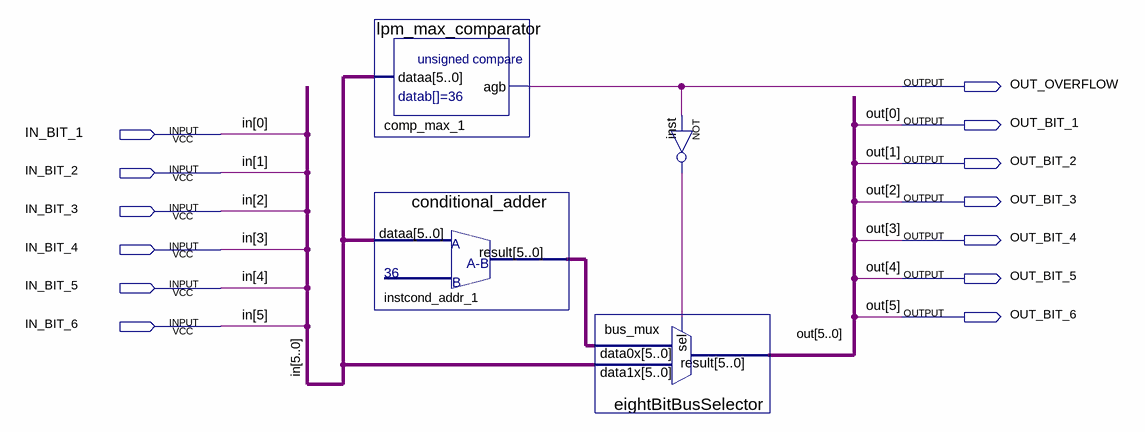
[diagram p0: schematic sheet]
// Quartus schematic counter_limiter_36.bdf as structural Verilog: 4 symbols, 13 pins
module counter_limiter_36 (
  input  IN_BIT_1,
  input  IN_BIT_2,
  input  IN_BIT_3,
  input  IN_BIT_4,
  input  IN_BIT_5,
  input  IN_BIT_6,
  output OUT_OVERFLOW,
  output OUT_BIT_1,
  output OUT_BIT_2,
  output OUT_BIT_3,
  output OUT_BIT_4,
  output OUT_BIT_5,
  output OUT_BIT_6
);

  wire inst_out;
  wire [5:0] instcond_addr_1_result;

  lpm_max_comparator comp_max_1 (
    .dataa({IN_BIT_6, IN_BIT_5, IN_BIT_4, IN_BIT_3, IN_BIT_2, IN_BIT_1}), .agb(OUT_OVERFLOW));
  conditional_adder instcond_addr_1 (
    .dataa({IN_BIT_6, IN_BIT_5, IN_BIT_4, IN_BIT_3, IN_BIT_2, IN_BIT_1}), .result(instcond_addr_1_result));
  eightBitBusSelector bus_mux (
    .data1x({IN_BIT_6, IN_BIT_5, IN_BIT_4, IN_BIT_3, IN_BIT_2, IN_BIT_1}), .data0x(instcond_addr_1_result),
    .sel(inst_out), .result({OUT_BIT_6, OUT_BIT_5, OUT_BIT_4, OUT_BIT_3, OUT_BIT_2, OUT_BIT_1}));
  not inst (inst_out, OUT_OVERFLOW);

  // Other names for the same wires on the sheet: in[5:0] = {IN_BIT_6, IN_BIT_5, IN_BIT_4, IN_BIT_3, IN_BIT_2, IN_BIT_1};
  //   out[5:0] = {OUT_BIT_6, OUT_BIT_5, OUT_BIT_4, OUT_BIT_3, OUT_BIT_2, OUT_BIT_1}
endmodule
